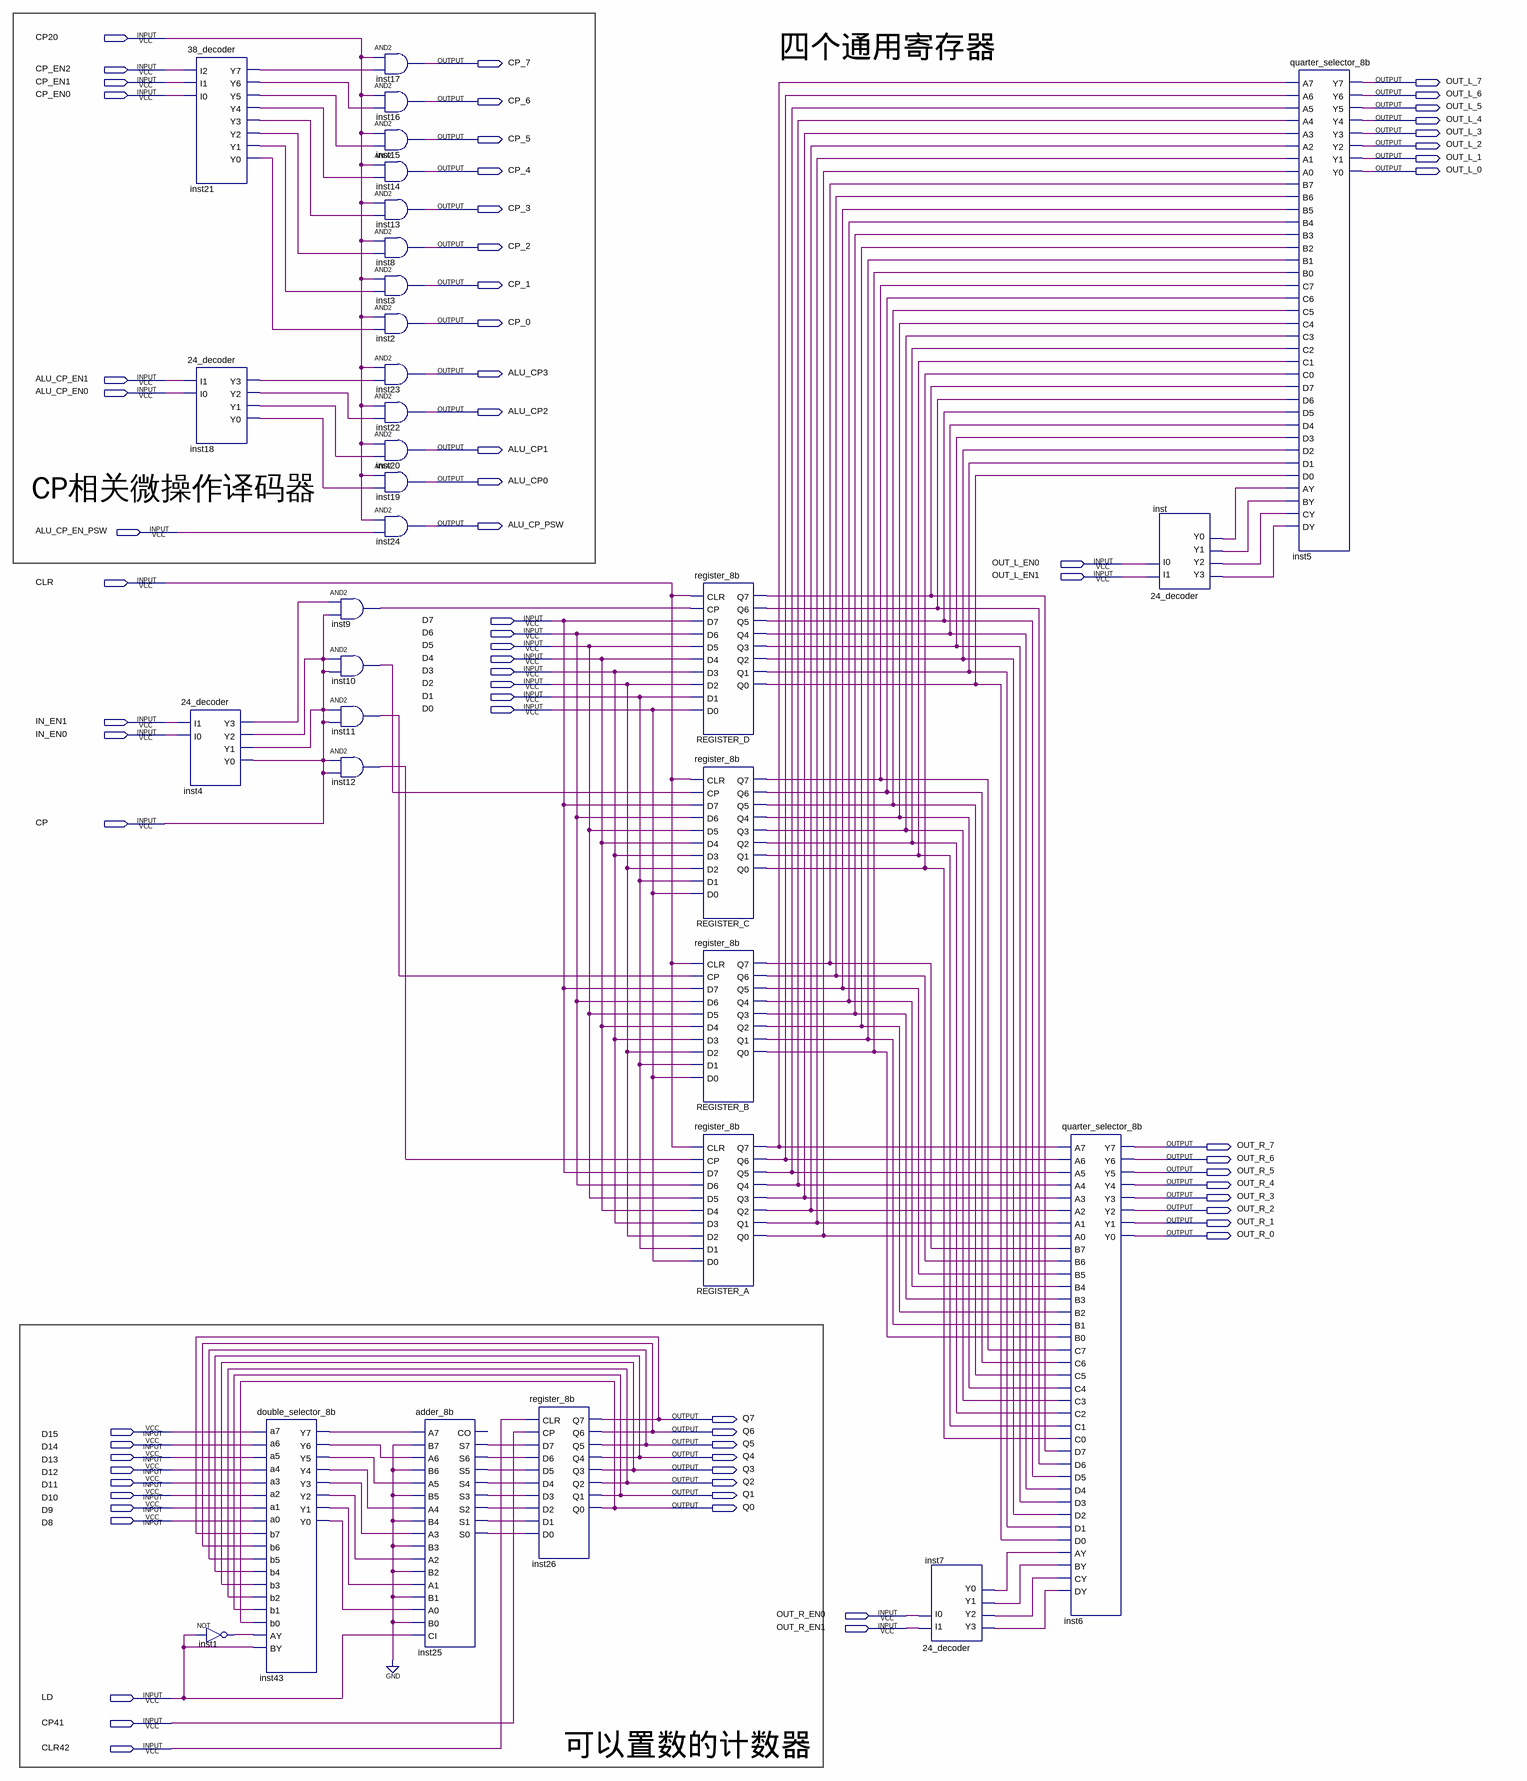
[diagram p0: schematic sheet]
// Quartus schematic print3.bdf as structural Verilog: 32 symbols, 71 pins
module print3 (
  input  CP20,
  input  CP_EN2,
  input  CP_EN1,
  input  CP_EN0,
  input  ALU_CP_EN1,
  input  ALU_CP_EN0,
  input  ALU_CP_EN_PSW,
  input  OUT_L_EN0,
  input  OUT_L_EN1,
  input  CLR,
  input  D7,
  input  D6,
  input  D5,
  input  D4,
  input  D3,
  input  D2,
  input  D1,
  input  D0,
  input  IN_EN1,
  input  IN_EN0,
  input  CP,
  input  D15,
  input  D14,
  input  D13,
  input  D12,
  input  D11,
  input  D10,
  input  D9,
  input  D8,
  input  OUT_R_EN0,
  input  OUT_R_EN1,
  input  LD,
  input  CP41,
  input  CLR42,
  output CP_7,
  output OUT_L_7,
  output OUT_L_6,
  output CP_6,
  output OUT_L_5,
  output OUT_L_4,
  output OUT_L_3,
  output CP_5,
  output OUT_L_2,
  output OUT_L_1,
  output CP_4,
  output OUT_L_0,
  output CP_3,
  output CP_2,
  output CP_1,
  output CP_0,
  output ALU_CP3,
  output ALU_CP2,
  output ALU_CP1,
  output ALU_CP0,
  output ALU_CP_PSW,
  output OUT_R_7,
  output OUT_R_6,
  output OUT_R_5,
  output OUT_R_4,
  output OUT_R_3,
  output OUT_R_2,
  output OUT_R_1,
  output OUT_R_0,
  output Q7,
  output Q6,
  output Q5,
  output Q4,
  output Q3,
  output Q2,
  output Q1,
  output Q0
);

  wire inst1_out, inst4_y3, inst7_y0, inst7_y1, inst7_y2, inst7_y3, inst9_out, inst10_out, inst11_out,
       inst12_out, inst18_y0, inst18_y1, inst18_y2, inst18_y3, inst21_y0, inst21_y1, inst21_y2, inst21_y3,
       inst21_y4, inst21_y5, inst21_y6, inst21_y7, inst25_s0, inst25_s1, inst25_s2, inst25_s3, inst25_s4,
       inst25_s5, inst25_s6, inst25_s7, inst43_y0, inst43_y1, inst43_y2, inst43_y3, inst43_y4, inst43_y5,
       inst43_y6, inst43_y7, inst_y0, inst_y1, inst_y2, inst_y3, REGISTER_A_q0, REGISTER_A_q1, REGISTER_A_q2,
       REGISTER_A_q3, REGISTER_A_q4, REGISTER_A_q5, REGISTER_A_q6, REGISTER_A_q7, REGISTER_B_q0,
       REGISTER_B_q1, REGISTER_B_q2, REGISTER_B_q3, REGISTER_B_q4, REGISTER_B_q5, REGISTER_B_q6,
       REGISTER_B_q7, REGISTER_C_q0, REGISTER_C_q1, REGISTER_C_q2, REGISTER_C_q3, REGISTER_C_q4,
       REGISTER_C_q5, REGISTER_C_q6, REGISTER_C_q7, REGISTER_D_q0, REGISTER_D_q1, REGISTER_D_q2,
       REGISTER_D_q3, REGISTER_D_q4, REGISTER_D_q5, REGISTER_D_q6, REGISTER_D_q7;

  \24_decoder  inst4 (.I1(IN_EN1), .I0(IN_EN0), .Y3(inst4_y3), .Y2(CP), .Y1(CP), .Y0(CP));
  \38_decoder  inst21 (
    .I2(CP_EN2), .I1(CP_EN1), .I0(CP_EN0), .Y7(inst21_y7), .Y6(inst21_y6), .Y5(inst21_y5), .Y4(inst21_y4),
    .Y3(inst21_y3), .Y2(inst21_y2), .Y1(inst21_y1), .Y0(inst21_y0));
  \24_decoder  inst18 (
    .I1(ALU_CP_EN1), .I0(ALU_CP_EN0), .Y3(inst18_y3), .Y2(inst18_y2), .Y1(inst18_y1), .Y0(inst18_y0));
  not inst1 (inst1_out, LD);
  double_selector_8b inst43 (
    .a0(D8), .a1(D9), .a2(D10), .a3(D11), .a4(D12), .a5(D13), .a6(D14), .a7(D15), .b0(Q0), .b1(Q1), .b2(Q2),
    .b3(Q3), .b4(Q4), .b5(Q5), .b6(Q6), .b7(Q7), .AY(inst1_out), .BY(LD), .Y0(inst43_y0), .Y1(inst43_y1),
    .Y2(inst43_y2), .Y3(inst43_y3), .Y4(inst43_y4), .Y5(inst43_y5), .Y6(inst43_y6), .Y7(inst43_y7));
  and inst9 (inst9_out, inst4_y3, CP);
  and inst10 (inst10_out, CP, CP);
  and inst11 (inst11_out, CP, CP);
  and inst12 (inst12_out, CP, CP);
  and inst17 (CP_7, CP20, inst21_y7);
  and inst16 (CP_6, CP20, inst21_y6);
  and inst15 (CP_5, CP20, inst21_y5);
  and inst14 (CP_4, CP20, inst21_y4);
  and inst13 (CP_3, CP20, inst21_y3);
  and inst8 (CP_2, CP20, inst21_y2);
  and inst3 (CP_1, CP20, inst21_y1);
  and inst2 (CP_0, CP20, inst21_y0);
  and inst23 (ALU_CP3, CP20, inst18_y3);
  and inst22 (ALU_CP2, CP20, inst18_y2);
  and inst20 (ALU_CP1, CP20, inst18_y1);
  and inst19 (ALU_CP0, CP20, inst18_y0);
  and inst24 (ALU_CP_PSW, CP20, ALU_CP_EN_PSW);
  adder_8b inst25 (
    .A7(inst43_y7), .B7(1'b0), .A6(inst43_y6), .B6(1'b0), .A5(inst43_y5), .B5(1'b0), .A4(inst43_y4),
    .B4(1'b0), .A3(inst43_y3), .B3(1'b0), .A2(inst43_y2), .B2(1'b0), .A1(inst43_y1), .B1(1'b0),
    .A0(inst43_y0), .B0(1'b0), .CI(LD), .S7(inst25_s7), .S6(inst25_s6), .S5(inst25_s5), .S4(inst25_s4),
    .S3(inst25_s3), .S2(inst25_s2), .S1(inst25_s1), .S0(inst25_s0));  // open: CO
  register_8b inst26 (
    .CLR(CLR42), .CP(CP41), .D7(inst25_s7), .D6(inst25_s6), .D5(inst25_s5), .D4(inst25_s4), .D3(inst25_s3),
    .D2(inst25_s2), .D1(inst25_s1), .D0(inst25_s0), .Q7(Q7), .Q6(Q6), .Q5(Q5), .Q4(Q4), .Q3(Q3), .Q2(Q2),
    .Q1(Q1), .Q0(Q0));
  register_8b REGISTER_D (
    .CLR(CLR), .CP(inst9_out), .D7(D7), .D6(D6), .D5(D5), .D4(D4), .D3(D3), .D2(D2), .D1(D1), .D0(D0),
    .Q7(REGISTER_D_q7), .Q6(REGISTER_D_q6), .Q5(REGISTER_D_q5), .Q4(REGISTER_D_q4), .Q3(REGISTER_D_q3),
    .Q2(REGISTER_D_q2), .Q1(REGISTER_D_q1), .Q0(REGISTER_D_q0));
  register_8b REGISTER_C (
    .CLR(CLR), .CP(inst10_out), .D7(D7), .D6(D6), .D5(D5), .D4(D4), .D3(D3), .D2(D2), .D1(D1), .D0(D0),
    .Q7(REGISTER_C_q7), .Q6(REGISTER_C_q6), .Q5(REGISTER_C_q5), .Q4(REGISTER_C_q4), .Q3(REGISTER_C_q3),
    .Q2(REGISTER_C_q2), .Q1(REGISTER_C_q1), .Q0(REGISTER_C_q0));
  register_8b REGISTER_B (
    .CLR(CLR), .CP(inst11_out), .D7(D7), .D6(D6), .D5(D5), .D4(D4), .D3(D3), .D2(D2), .D1(D1), .D0(D0),
    .Q7(REGISTER_B_q7), .Q6(REGISTER_B_q6), .Q5(REGISTER_B_q5), .Q4(REGISTER_B_q4), .Q3(REGISTER_B_q3),
    .Q2(REGISTER_B_q2), .Q1(REGISTER_B_q1), .Q0(REGISTER_B_q0));
  register_8b REGISTER_A (
    .CLR(CLR), .CP(inst12_out), .D7(D7), .D6(D6), .D5(D5), .D4(D4), .D3(D3), .D2(D2), .D1(D1), .D0(D0),
    .Q7(REGISTER_A_q7), .Q6(REGISTER_A_q6), .Q5(REGISTER_A_q5), .Q4(REGISTER_A_q4), .Q3(REGISTER_A_q3),
    .Q2(REGISTER_A_q2), .Q1(REGISTER_A_q1), .Q0(REGISTER_A_q0));
  \24_decoder  inst7 (.I1(OUT_R_EN1), .I0(OUT_R_EN0), .Y3(inst7_y3), .Y2(inst7_y2), .Y1(inst7_y1), .Y0(inst7_y0));
  quarter_selector_8b inst6 (
    .A7(REGISTER_A_q7), .A6(REGISTER_A_q6), .A5(REGISTER_A_q5), .A4(REGISTER_A_q4), .A3(REGISTER_A_q3),
    .A2(REGISTER_A_q2), .A1(REGISTER_A_q1), .A0(REGISTER_A_q0), .B7(REGISTER_B_q7), .B6(REGISTER_B_q6),
    .B5(REGISTER_B_q5), .B4(REGISTER_B_q4), .B3(REGISTER_B_q3), .B2(REGISTER_B_q2), .B1(REGISTER_B_q1),
    .B0(REGISTER_B_q0), .AY(inst7_y0), .BY(inst7_y1), .C7(REGISTER_C_q7), .C6(REGISTER_C_q6),
    .C5(REGISTER_C_q5), .C4(REGISTER_C_q4), .C3(REGISTER_C_q3), .C2(REGISTER_C_q2), .C1(REGISTER_C_q1),
    .C0(REGISTER_C_q0), .D7(REGISTER_D_q7), .D6(REGISTER_D_q6), .D5(REGISTER_D_q5), .D4(REGISTER_D_q4),
    .D3(REGISTER_D_q3), .D2(REGISTER_D_q2), .D1(REGISTER_D_q1), .D0(REGISTER_D_q0), .CY(inst7_y2),
    .DY(inst7_y3), .Y7(OUT_R_7), .Y6(OUT_R_6), .Y5(OUT_R_5), .Y4(OUT_R_4), .Y3(OUT_R_3), .Y2(OUT_R_2),
    .Y1(OUT_R_1), .Y0(OUT_R_0));
  \24_decoder  inst (.I1(OUT_L_EN1), .I0(OUT_L_EN0), .Y3(inst_y3), .Y2(inst_y2), .Y1(inst_y1), .Y0(inst_y0));
  quarter_selector_8b inst5 (
    .A7(REGISTER_A_q7), .A6(REGISTER_A_q6), .A5(REGISTER_A_q5), .A4(REGISTER_A_q4), .A3(REGISTER_A_q3),
    .A2(REGISTER_A_q2), .A1(REGISTER_A_q1), .A0(REGISTER_A_q0), .B7(REGISTER_B_q7), .B6(REGISTER_B_q6),
    .B5(REGISTER_B_q5), .B4(REGISTER_B_q4), .B3(REGISTER_B_q3), .B2(REGISTER_B_q2), .B1(REGISTER_B_q1),
    .B0(REGISTER_B_q0), .AY(inst_y0), .BY(inst_y1), .C7(REGISTER_C_q7), .C6(REGISTER_C_q6),
    .C5(REGISTER_C_q5), .C4(REGISTER_C_q4), .C3(REGISTER_C_q3), .C2(REGISTER_C_q2), .C1(REGISTER_C_q1),
    .C0(REGISTER_C_q0), .D7(REGISTER_D_q7), .D6(REGISTER_D_q6), .D5(REGISTER_D_q5), .D4(REGISTER_D_q4),
    .D3(REGISTER_D_q3), .D2(REGISTER_D_q2), .D1(REGISTER_D_q1), .D0(REGISTER_D_q0), .CY(inst_y2),
    .DY(inst_y3), .Y7(OUT_L_7), .Y6(OUT_L_6), .Y5(OUT_L_5), .Y4(OUT_L_4), .Y3(OUT_L_3), .Y2(OUT_L_2),
    .Y1(OUT_L_1), .Y0(OUT_L_0));

  // Notes on the sheet:
  //   四个通用寄存器
  //   CP相关微操作译码器
  //   可以置数的计数器
endmodule
